# Altium schematic sheet Expansion Headers.SchDoc: DaughterBoard Tester
size Letter; DrawnBy: MTAN; Organization: Altium Limited; DocumentNumber: 2; Revision: A; SheetNumber: 2; SheetTotal: 6
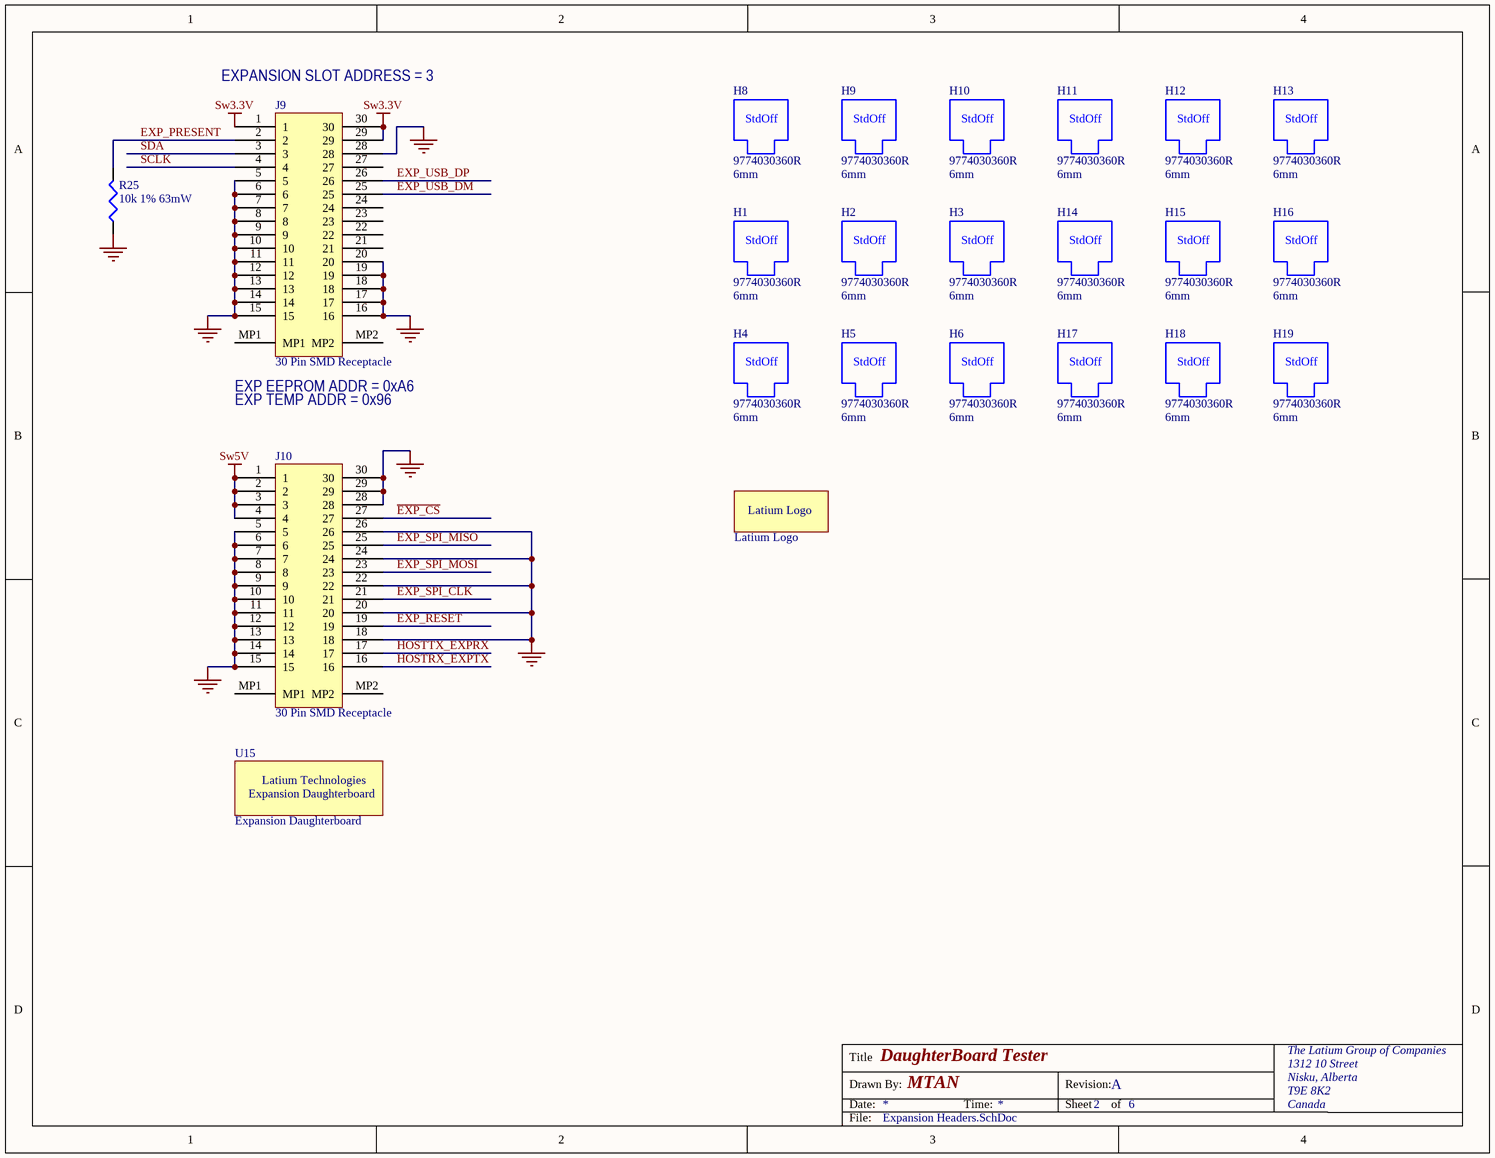
[diagram p0: Expansion Headers.SchDoc]

## Parts
H1  9774030360R  Height: 6mm  [Wurth 9774060360R]
H2  9774030360R  Height: 6mm  [Wurth 9774060360R]
H3  9774030360R  Height: 6mm  [Wurth 9774060360R]
H4  9774030360R  Height: 6mm  [Wurth 9774060360R]
H5  9774030360R  Height: 6mm  [Wurth 9774060360R]
H6  9774030360R  Height: 6mm  [Wurth 9774060360R]
H7  Latium Logo  [LatiumLogo]  (no BOM)
H8  9774030360R  Height: 6mm  [Wurth 9774060360R]
H9  9774030360R  Height: 6mm  [Wurth 9774060360R]
H10  9774030360R  Height: 6mm  [Wurth 9774060360R]
H11  9774030360R  Height: 6mm  [Wurth 9774060360R]
H12  9774030360R  Height: 6mm  [Wurth 9774060360R]
H13  9774030360R  Height: 6mm  [Wurth 9774060360R]
H14  9774030360R  Height: 6mm  [Wurth 9774060360R]
H15  9774030360R  Height: 6mm  [Wurth 9774060360R]
H16  9774030360R  Height: 6mm  [Wurth 9774060360R]
H17  9774030360R  Height: 6mm  [Wurth 9774060360R]
H18  9774030360R  Height: 6mm  [Wurth 9774060360R]
H19  9774030360R  Height: 6mm  [Wurth 9774060360R]
J9  30 Pin SMD Receptacle  [10132798-031100LF]
J10  30 Pin SMD Receptacle  [10132798-031100LF]
R25  10k 1% 63mW  [RESC1005L]
U15  Expansion Daughterboard  [Expansion Daughterboard]  (no BOM)

## Nets
GND: J9.5 J9.6 J9.7 J9.8 J9.9 J9.10 J9.11 J9.12 J9.13 J9.14 J9.15 J9.16 J9.17 J9.18 J9.19 J9.20 J9.28 J10.5 J10.6 J10.7 J10.8 J10.9 J10.10 J10.11 J10.12 J10.13 J10.14 J10.15 J10.18 J10.20 J10.22 J10.24 J10.26 J10.28 J10.29 J10.30 R25.1
Sw3.3V: J9.1 J9.29 J9.30
Sw5V: J10.1 J10.2 J10.3 J10.4
~{EXP_CS}: J10.27
EXP_PRESENT: J9.2 R25.2
EXP_RESET: J10.19
EXP_SPI_CLK: J10.21
EXP_SPI_MISO: J10.25
EXP_SPI_MOSI: J10.23
EXP_USB_DM: J9.25
EXP_USB_DP: J9.26
HOSTRX_EXPTX: J10.16
HOSTTX_EXPRX: J10.17
SCLK: J9.4
SDA: J9.3

Not connected (* = marked no-connect by the designer): J9 21 22 23 24 27 MP1 MP2; J10 MP1 MP2

## Notes on the sheet
- (near J9) EXPANSION SLOT ADDRESS = 3
- (near J9) EXP EEPROM ADDR = 0xA6
- EXP TEMP ADDR = 0x96
- Title
- Drawn By:
- Date:
- Time:
- Revision:
- Sheet
- of
- The Latium Group of Companies
- 1312 10 Street
- Nisku, Alberta
- T9E 8K2
- Canada
- File:
- (in symbol Expansion Daughterboard) Latium Technologies
- (in symbol SMD M3 Spacer) StdOff

## Library data of the parts
H1-H6 H8-H19 = SMD M3 Spacer: ROUND STANDOFF M3X0.5 STEEL 6MM; Manufacturer: Wurth Electronics Inc; Manufacturer Part Number: 9774060360R; Supplier 1: Digi-Key; Value: 9774030360R; ComponentLink1Description: Drawing; ComponentLink1URL: S:\Hardware\Data Sheets\Passive\Spacers\Wurth 9774060360R.pdf; Supplier 1 Part Number: 732-5273-1-ND
J9 J10 = Amphenol 30 Pos BergStak Plug: CONN RCPT 30POS SMD GOLD; Manufacturer: Amphenol ICC (FCI); Note: Mates with 10132797-031100LF plug 3mm between board height; Value: 30 Pin SMD Receptacle; Manufacturer Part Number: 10132798-031100LF; Supplier 1: Digi-Key; Supplier 1 Part Number: 609-5030-1-ND
R25 = Res3: Resistor; Value: 10k 1% 63mW
H7 = Latium Logo: Value: Latium Logo
U15 = Expansion Daughterboard: Value: Expansion Daughterboard